# Altium project Wireless_thermomometer.PrjPcb
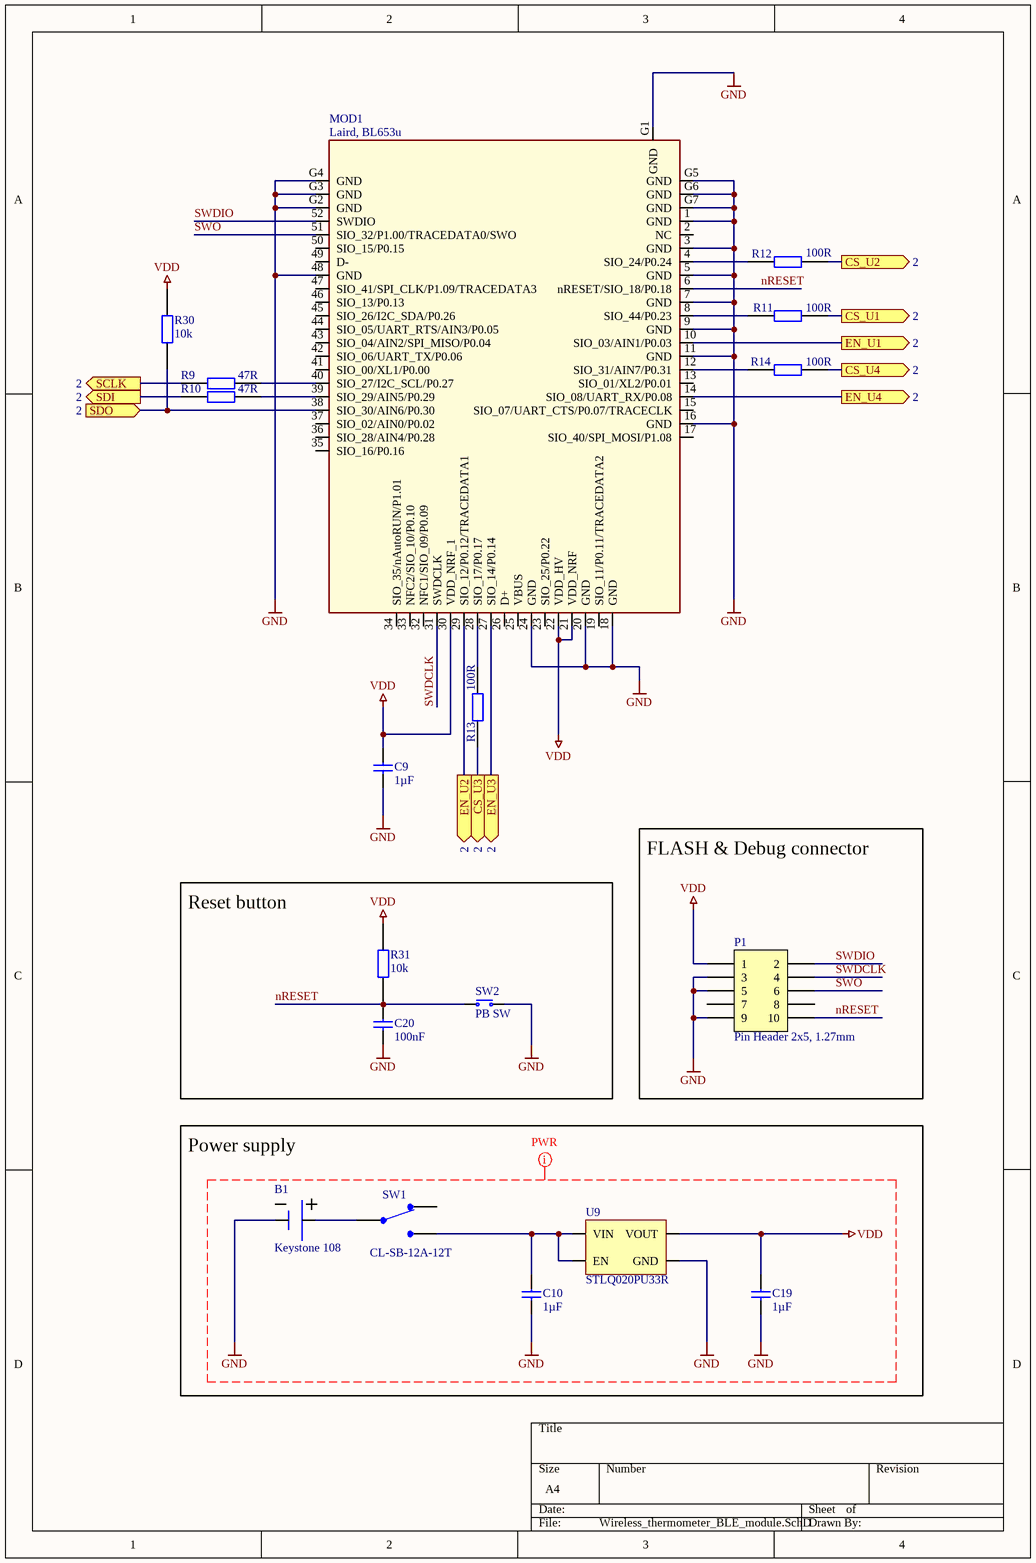
[diagram p0: Wireless_thermometer_BLE_module.SchDoc]
Name: Vladimír Pokorný; University_1: Brno University of Technology; University_2: Johannes Kepler University; URL: www.vladimirpokorny.cz
2 sheets, 74 parts. Net scope: flat (ports and power ports of the same name join across sheets).
Board files: Wireless_thermometer_one_PCB.PcbDoc, Wireless_thermometer_PCB_panel.PcbDoc
Sheets:
  Wireless_thermometer_BLE_module.SchDoc
  Wireless_thermometer_sensors.SchDoc

## Sheet Wireless_thermometer_BLE_module.SchDoc
size A4 portrait; SheetNumber: 1; SheetTotal: 2

### Parts
B1  Keystone 108  [Keystone 108]
C9  1µF  [CAPC1005X04L]
C10  1µF  [CAPC1005X04L]
C19  1µF  [CAPC1005X04L]
C20  100nF  [CAPC1005X04L]
MOD1  Laird, BL653u  [Laird, BL653u]
P1  Pin Header 2x5, 1.27mm  [HDR_2x5-SMD-1.27mm-K]
R9  47R  [RESC1005X04L]
R10  47R  [RESC1005X04L]
R11  100R  [RESC1005X04L]
R12  100R  [RESC1005X04L]
R13  100R  [RESC1005X04L]
R14  100R  [RESC1005X04L]
R30  10k  [RESC1005X04L]
R31  10k  [RESC1005X04L]
SW1  CL-SB-12A-12T  [CL-SB-12A-12T]
SW2  PB SW  [C&K_PTS810]
U9  STLQ020PU33R  [STLQ020PU33R]

### Ports
CS_U1 (out, see 2), CS_U2 (out, see 2), CS_U3 (out, see 2), CS_U4 (out, see 2), EN_U1 (out, see 2), EN_U2 (out, see 2), EN_U3 (out, see 2), EN_U4 (out, see 2), SCLK (out, see 2), SDI (out, see 2), SDO (in, see 2)

### Nets
GND: B1.2 C9.1 C10.1 C19.1 C20.1 MOD1.1(GND) MOD1.3(GND) MOD1.5(GND) MOD1.7(GND) MOD1.9(GND) MOD1.11(GND) MOD1.16(GND) MOD1.18(GND) MOD1.20(GND) MOD1.24(GND) MOD1.48(GND) MOD1.G1(GND) MOD1.G2(GND) MOD1.G3(GND) MOD1.G4(GND) MOD1.G5(GND) MOD1.G6(GND) MOD1.G7(GND) P1.3 P1.5 P1.9 SW2.1(N.O) U9.3(GND)
VDD: C9.2 C19.2 MOD1.21(VDD_NRF) MOD1.22(VDD_HV) MOD1.30(VDD_NRF_1) P1.1 R30.2 R31.2 U9.1(VOUT)
CS_U1: R11.2 ; port CS_U1
CS_U2: R12.2 ; port CS_U2
CS_U3: R13.2 ; port CS_U3
CS_U4: R14.2 ; port CS_U4
EN_U1: MOD1.10(SIO_03/AIN1/P0.03) ; port EN_U1
EN_U2: MOD1.29(SIO_12/P0.12/TRACEDATA1) ; port EN_U2
EN_U3: MOD1.27(SIO_14/P0.14) ; port EN_U3
EN_U4: MOD1.14(SIO_08/UART_RX/P0.08) ; port EN_U4
nRESET: C20.2 MOD1.6(nRESET/SIO_18/P0.18) P1.10 R31.1 SW2.2(COM)  [project net nRESET_1]
SCLK: R9.1 ; port SCLK
SDI: R10.1 ; port SDI
SDO: MOD1.38(SIO_30/AIN6/P0.30) R30.1 ; port SDO
SWDCLK: MOD1.31(SWDCLK) P1.4  [project net SWDCLK_1]
SWDIO: MOD1.52(SWDIO) P1.2  [project net SWDIO_1]
SWO: MOD1.51(SIO_32/P1.00/TRACEDATA0/SWO) P1.6  [project net SWO_1]
NetB1_1: B1.1 SW1.2
NetC10_2: C10.2 SW1.3 U9.4(EN) U9.6(VIN)
NetMOD1_4: MOD1.4(SIO_24/P0.24) R12.1
NetMOD1_8: MOD1.8(SIO_44/P0.23) R11.1
NetMOD1_12: MOD1.12(SIO_31/AIN7/P0.31) R14.1
NetMOD1_28: MOD1.28(SIO_17/P0.17) R13.1
NetMOD1_39: MOD1.39(SIO_29/AIN5/P0.29) R10.2
NetMOD1_40: MOD1.40(SIO_27/I2C_SCL/P0.27) R9.2

Not connected (* = marked no-connect by the designer): MOD1 2(NC) 13(SIO_01/XL2/P0.01) 15(SIO_07/UART_CTS/P0.07/TRACECLK) 17(SIO_40/SPI_MOSI/P1.08) 19(SIO_11/P0.11/TRACEDATA2) 23(SIO_25/P0.22___________) 25(VBUS) 26(D+) 32(NFC1/SIO_09/P0.09) 33(NFC2/SIO_10/P0.10) 34(SIO_35/nAutoRUN/P1.01) 35(SIO_16/P0.16) 36(SIO_28/AIN4/P0.28) 37(SIO_02/AIN0/P0.02) 41(SIO_00/XL1/P0.00) 42(SIO_06/UART_TX/P0.06) 43(SIO_04/AIN2/SPI_MISO/P0.04) 44(SIO_05/UART_RTS/AIN3/P0.05) 45(SIO_26/I2C_SDA/P0.26) 46(SIO_13/P0.13) 47(SIO_41/SPI_CLK/P1.09/TRACEDATA3) 49(D-) 50(SIO_15/P0.15); P1 7 8; SW1 1

### Layout directives
net class PWR: GND, VDD

### Notes on the sheet
- Reset button
- (near P1) FLASH & Debug connector
- Power supply

### Library data of the parts
B1 = Keystone 108: Tip Plg 108 Phe Bagged NKL#9HHS108; Manufacturer: Keystone Electronics; Manufacturer Part Number: 108; Body Material: Plastic; Number of Batteries: 1; Lead Length: 3.56mm; Approvals: UL; Supplier 1: Digi-Key; RoHS: Yes; Category: Batteries and Accessories; Stock 1: 10973; Pricing 1: 1=1,50000, 25=1,27160, 100=1,04920, 250=0,96544, 500=0,90634, 1000=0,84723, 2500=0,76842, 5000=0,70931 (USD); Mount: Through Hole,PCB,Screw; Number of Pins: 2; Material: Brass,Plastic; Contact Plating: Nickel,Tin; Contact Material: Brass,Nickel; Min Operating Temperature: -50°C; Max Operating Temperature: 145°C; Package Quantity: 1; Packaging: Tray; Termination: PC Pin; Number of Cells: 1; Series: -; Lead Free: Lead Free; REACH SVHC: No SVHC; ComponentLink1URL: https://datasheet.ciiva.com/3/108-3991.pdf?src-supplier=Digi-Key; ComponentLink1Description: https://datasheet.ciiva.com/3/108-3991.pdf?src-supplier=Digi-Key; ComponentLink2URL: https://datasheet.ciiva.com/1391/1718250-1391263.pdf?src-supplier=Element14; ComponentLink2Description: https://datasheet.ciiva.com/1391/1718250-1391263.pdf?src-supplier=Element14; ComponentLink3URL: https://datasheet.ciiva.com/20221/18-0102-20221614.pdf?src-supplier=Rapid+Electronics; ComponentLink3Description: https://datasheet.ciiva.com/20221/18-0102-20221614.pdf?src-supplier=Rapid+Electronics; ComponentLink4URL: https://datasheet.ciiva.com/20221/18-2995-20221661.pdf?src-supplier=Rapid+Electronics; ComponentLink4Description: https://datasheet.ciiva.com/20221/18-2995-20221661.pdf?src-supplier=Rapid+Electronics; ComponentLink5URL: https://datasheet.ciiva.com/16322/m60-2p18-16322534.pdf?src-supplier=Future+Electronics; ComponentLink5Description: https://datasheet.ciiva.com/16322/m60-2p18-16322534.pdf?src-supplier=Future+Electronics; Supplier Part Number 1: 36-108-ND
C9 C10 C19 C20 = CAP_0402: Capacitor, X7R, ±10%; Part Number: C0402-1µ0; LatestRevisionDate: 2016-08-22; Pin Count: 2; Publisher: Nordic Semiconductor; Published: 2009-05-08; Footprint Doc: 0402
  C9 C10 C19: Value: 1µF
  C20: Value: 100nF
MOD1 = Laird, BL653u: BL653µ Integrated Antenna module, 453-00059; Substitutes Allowed: NO; Datasheet Link: https://connectivity-staging.s3.us-east-2.amazonaws.com/s3fs-public/2018-12/BL654%20Datasheet%20v1_6.pdf; Mounting: SMT; Operating Temperature: -40C~85C; Manufacturer Part Number: 453-00059; Manufacturer: Laird; Footprint: Laird, Module, BL653u-SA
P1 = Pin Header 2x5 SMD, 1.27mm, KS: Pin Header 2x5, 1.27mm (50mil), SMD, Keying Shroud; Manufacturer: W-CON; Manufacturer Part Number: 3132-10MS0BK00R1; Part number IPS: 00000009968; Artikkelnr Noca: 55010009; Part Number: Pin Header 2x5 SMD, 1.27mm, KS; Footprint Doc: HDR_2x5-SMD-1.27mm; LatestRevisionDate: 2016-04-21; Pin Count: 10; Publisher: Nordic Semiconductor; Published: 2016-01-22; Value: Pin Header 2x5, 1.27mm; Note: *; ComponentLink1URL: *; ComponentLink1Description: Datasheet; ComponentLink2URL: *; ComponentLink2Description: Supplier link; HelpURL: \\hizz\pro\app9717\Datasheet\connectores\W-CON\3132-XXMXXBK00XX.pdf; Supplier 1: Cabcon; Supplier Part Number 1: 3132-10MS0BK00R1; Supplier 2: Samtec; Supplier Part Number 2: FTSH-105-01-F-DV-K
R9 R10 = RES_0402: Resistor; Part Number: R0603-430R; Value: 430R; LatestRevisionDate: 2015-06-10; Pin Count: 2; Publisher: Nordic Semiconductor; Published: 2015-06-10; Footprint Doc: 0603
R11-R14 R30 R31 = RES_0402: Resistor; Part Number: R0603-430R; LatestRevisionDate: 2015-06-10; Pin Count: 2; Publisher: Nordic Semiconductor; Published: 2015-06-10; Footprint Doc: 0603
  R11-R14: Value: 100R
  R30 R31: Value: 10k
SW1 = CL-SB-12A-12T: Slide Switch, 2 Positions, SPDT, Latched, 0.2A, 12VDC, Solder Terminal, Through Hole-right Angle; Manufacturer: Nidec Copal; Actuator Material: Nylon,Polyamide; Contact Style: Non-Shorting; Electrical Life: 10000Cycles; Actuator Type: Standard; Switch Function: On-On; Switch Travel: 2mm; Current Rating: 200mA; Voltage Rating (DC): 12V; Operating Force: 153gf; Supplier 1: Newark; Manufacturer Part Number: CL-SB-12A-12T; RoHS: Yes; Category: Slide Switches; Stock 1: 490; Pricing 1: 1=1,08000, 10=1,03000, 25=0,97200, 50=0,91300, 100=0,85000, 250=0,78000 (USD); Mount: Surface Mount; Contact Plating: Gold; Contact Material: Copper; Min Operating Temperature: -40°C; Max Operating Temperature: 85°C; Throw Configuration: SPDT; Packaging: Tape and Reel; Actuator Length: 2mm; ComponentLink1URL: https://datasheet.ciiva.com/6462/cl-sb-6462005.pdf?src-supplier=Digi-Key; ComponentLink1Description: https://datasheet.ciiva.com/6462/cl-sb-6462005.pdf?src-supplier=Digi-Key; ComponentLink2URL: https://datasheet.ciiva.com/6462/cl-sb-6462006.pdf?src-supplier=Digi-Key; ComponentLink2Description: https://datasheet.ciiva.com/6462/cl-sb-6462006.pdf?src-supplier=Digi-Key; ComponentLink3URL: https://datasheet.ciiva.com/6462/cl-sb-6462009.pdf?src-supplier=Digi-Key; ComponentLink3Description: https://datasheet.ciiva.com/6462/cl-sb-6462009.pdf?src-supplier=Digi-Key; Supplier Part Number 1: 56AC5276
SW2 = PTS810 SJK 250 SMTR LFS: Tactile Switch, SPNO, SMD, 260gf, 4.2x3.2x2.5mm; Manufacturer: C&K Components; Part number IPS: 00000001259; Artikkelnr Noca: N.A.; Part Number: PTS810 SJK 250 SMTR LFS; Manufacturer Part Number: PTS810 SJK 250 SMTR LFS; LatestRevisionDate: 2017-11-09; Pin Count: 4; Publisher: Nordic Semiconductor; Published: 2017-09-18; Value: PB SW; Note: *; Footprint Doc: PTS810; ComponentLink1Description: Datasheet; ComponentLink1URL: *; ComponentLink2Description: Supplier link; ComponentLink2URL: *; HelpURL: http://www.ckswitches.com/media/1476/pts810.pdf; Supplier 1: Digi-Key; Supplier Part Number 1: CKN10503TR-ND; Supplier 2: *; Supplier Part Number 2: *
U9 = STLQ020PU33R: Ldo, Fixed, 3.3V, 0.2A, -40 to 125DEG C;; Manufacturer: STMicroelectronics; Supplier 1: Mouser; Manufacturer Part Number: STLQ020PU33R; RoHS: No; Category: Uncategorized; Stock 1: 5768; Pricing 1: 1=0,60000, 10=0,49400, 50=0,49400, 100=0,40300, 1000=0,25500, 10000=0,24000 (USD); Supplier Part Number 1: 511-STLQ020PU33R

## Sheet Wireless_thermometer_sensors.SchDoc
size A3; SheetNumber: 2; SheetTotal: 2
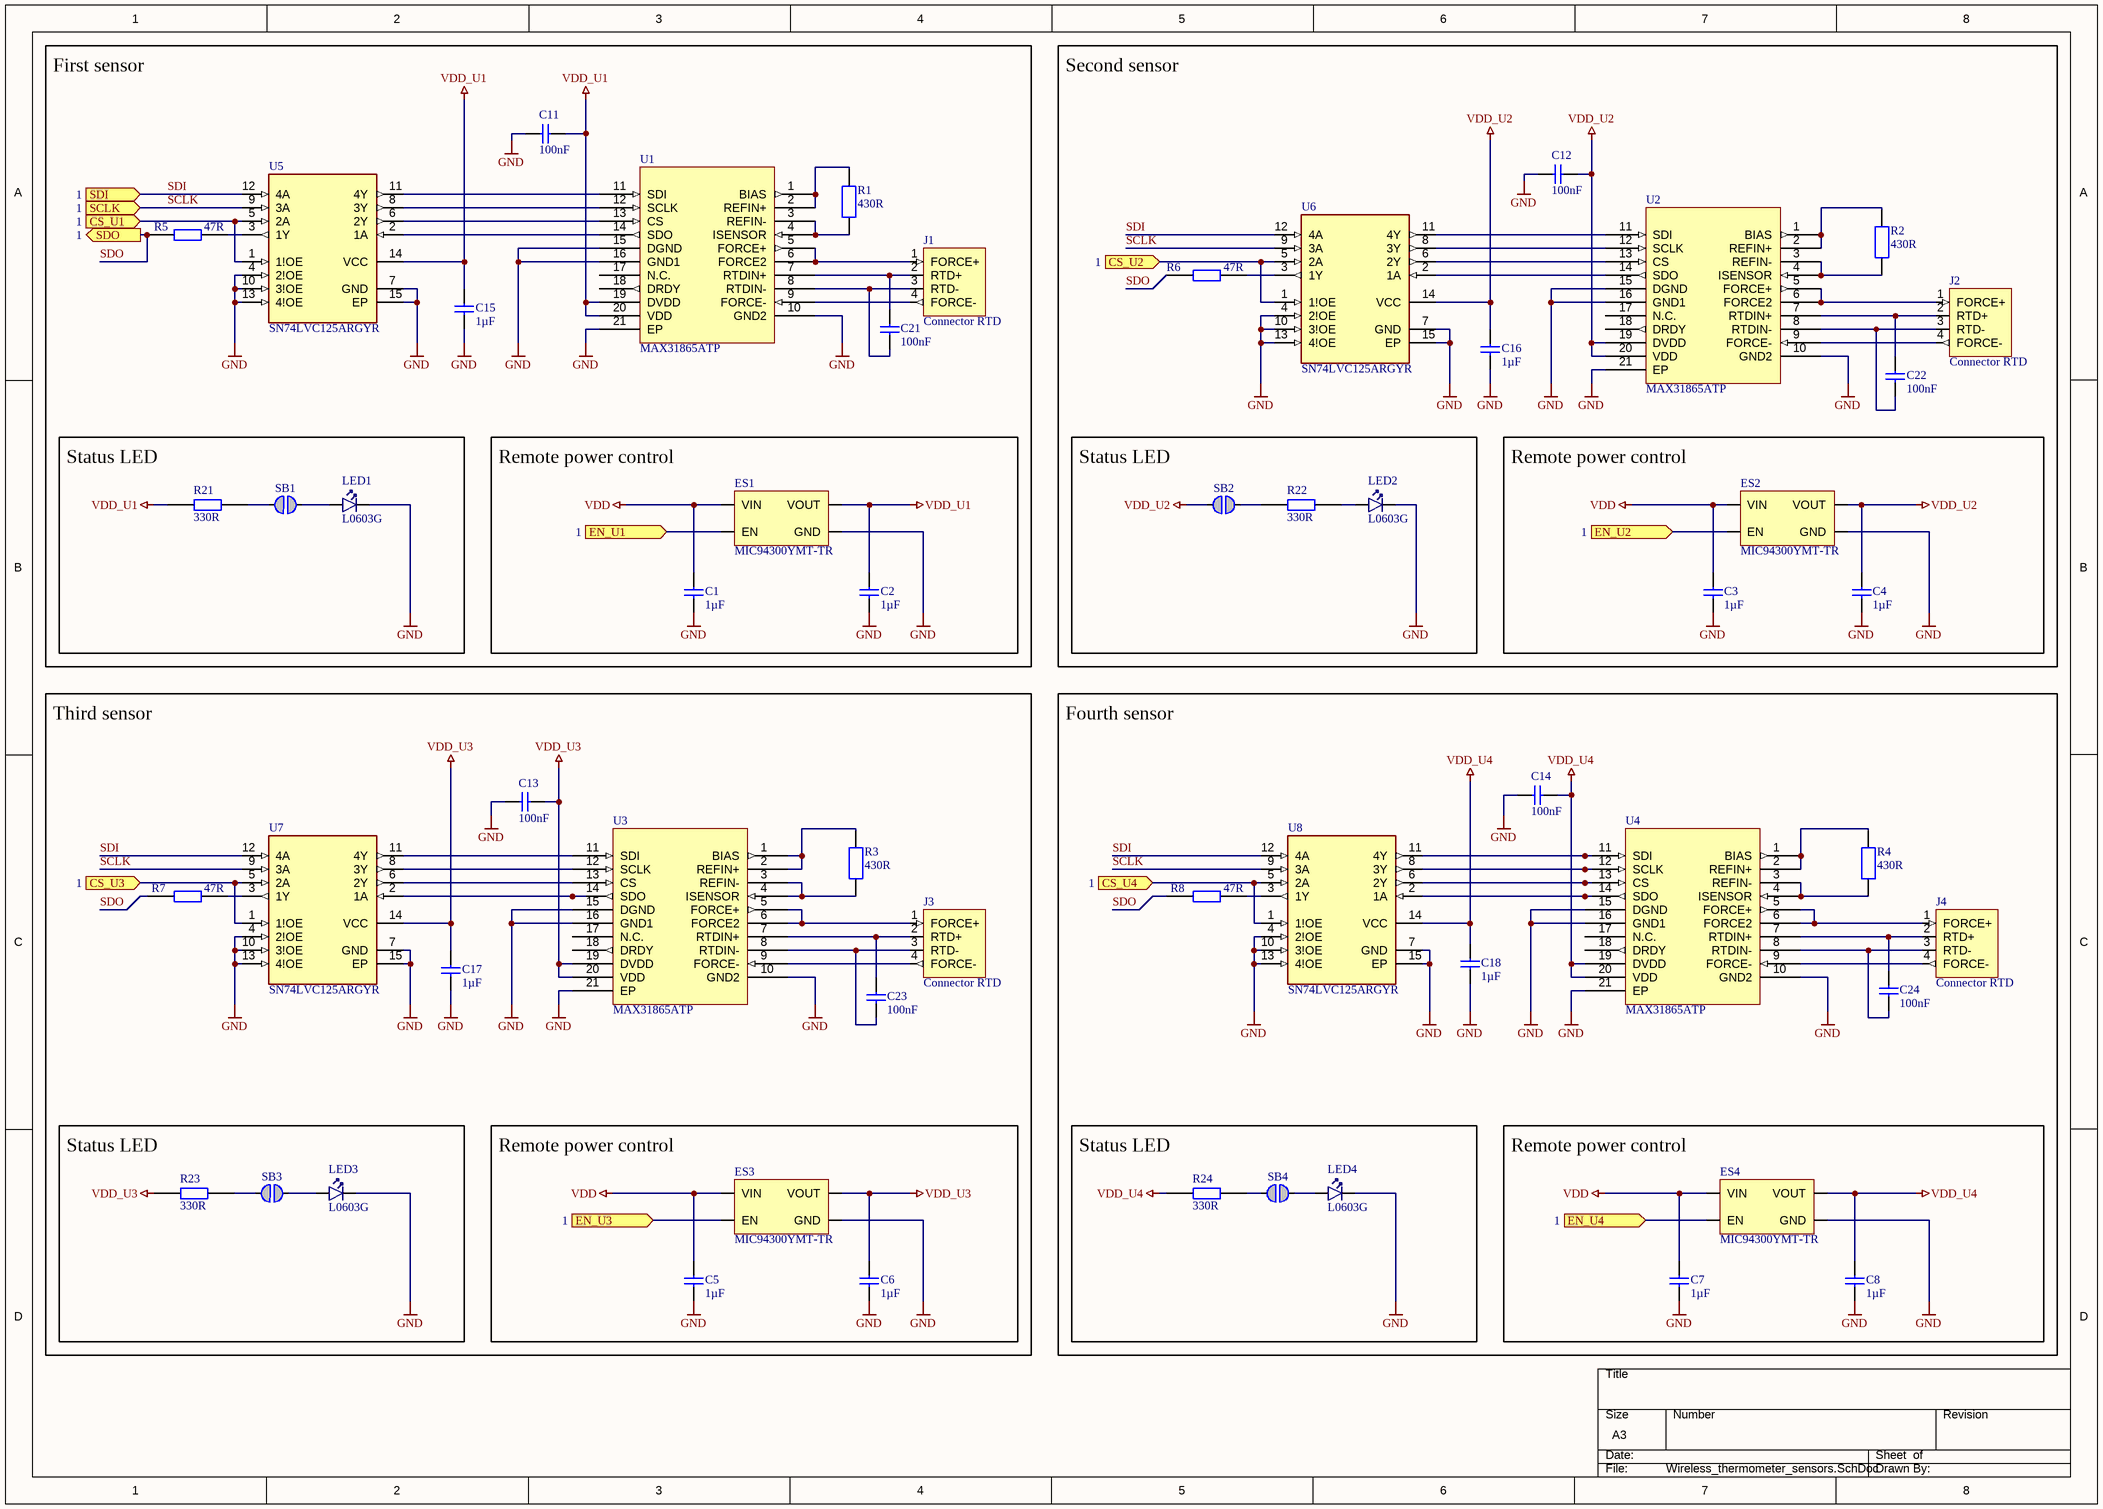
[diagram p1: Wireless_thermometer_sensors.SchDoc]

### Parts
C1  1µF  [CAPC1005X04L]
C2  1µF  [CAPC1005X04L]
C3  1µF  [CAPC1005X04L]
C4  1µF  [CAPC1005X04L]
C5  1µF  [CAPC1005X04L]
C6  1µF  [CAPC1005X04L]
C7  1µF  [CAPC1005X04L]
C8  1µF  [CAPC1005X04L]
C11  100nF  [CAPC1005X04L]
C12  100nF  [CAPC1005X04L]
C13  100nF  [CAPC1005X04L]
C14  100nF  [CAPC1005X04L]
C15  1µF  [CAPC1005X04L]
C16  1µF  [CAPC1005X04L]
C17  1µF  [CAPC1005X04L]
C18  1µF  [CAPC1005X04L]
C21  100nF  [CAPC1005X04L]
C22  100nF  [CAPC1005X04L]
C23  100nF  [CAPC1005X04L]
C24  100nF  [CAPC1005X04L]
ES1  MIC94300YMT-TR  [MIC94300YMT-TR]
ES2  MIC94300YMT-TR  [MIC94300YMT-TR]
ES3  MIC94300YMT-TR  [MIC94300YMT-TR]
ES4  MIC94300YMT-TR  [MIC94300YMT-TR]
J1  Connector RTD  [CON-RTD]
J2  Connector RTD  [CON-RTD]
J3  Connector RTD  [CON-RTD]
J4  Connector RTD  [CON-RTD]
LED1  L0603G  [LED_0603_G]
LED2  L0603G  [LED_0603_G]
LED3  L0603G  [LED_0603_G]
LED4  L0603G  [LED_0603_G]
R1  430R  [RESR1608X06]
R2  430R  [RESR1608X06]
R3  430R  [RESR1608X06]
R4  430R  [RESR1608X06]
R5  47R  [RESC1005X04L]
R6  47R  [RESC1005X04L]
R7  47R  [RESC1005X04L]
R8  47R  [RESC1005X04L]
R21  330R  [RESC1005X04L]
R22  330R  [RESC1005X04L]
R23  330R  [RESC1005X04L]
R24  330R  [RESC1005X04L]
SB1  Solderbridge  [Solderbridge]  (value not drawn)  (no BOM)
SB2  Solderbridge  [Solderbridge]  (value not drawn)  (no BOM)
SB3  Solderbridge  [Solderbridge]  (value not drawn)  (no BOM)
SB4  Solderbridge  [Solderbridge]  (value not drawn)  (no BOM)
U1  MAX31865ATP  [21-0140L_T2055-5_MXM-L]
U2  MAX31865ATP  [21-0140L_T2055-5_MXM-L]
U3  MAX31865ATP  [21-0140L_T2055-5_MXM-L]
U4  MAX31865ATP  [21-0140L_T2055-5_MXM-L]
U5  SN74LVC125ARGYR  [QFN50P350X350X100-15N]
U6  SN74LVC125ARGYR  [QFN50P350X350X100-15N]
U7  SN74LVC125ARGYR  [QFN50P350X350X100-15N]
U8  SN74LVC125ARGYR  [QFN50P350X350X100-15N]

### Ports
CS_U1 (in, see 1), CS_U2 (in, see 1), CS_U3 (in, see 1), CS_U4 (in, see 1), EN_U1 (in, see 1), EN_U2 (in, see 1), EN_U3 (in, see 1), EN_U4 (in, see 1), SCLK (in, see 1), SDI (in, see 1), SDO (out, see 1)

### Nets
GND: C1.1 C2.1 C3.1 C4.1 C5.1 C6.1 C7.1 C8.1 C11.1 C12.1 C13.2 C14.1 C15.1 C16.1 C17.1 C18.1 ES1.2(GND) ES2.2(GND) ES3.2(GND) ES4.2(GND) LED1.1(C) LED2.1(C) LED3.1(C) LED4.1(C) U1.10(GND2) U1.15(DGND) U1.16(GND1) U1.21(EP) U2.10(GND2) U2.15(DGND) U2.16(GND1) U2.21(EP) U3.10(GND2) U3.15(DGND) U3.16(GND1) U3.21(EP) U4.10(GND2) U4.15(DGND) U4.16(GND1) U4.21(EP) U5.4(2!OE) U5.7(GND) U5.10(3!OE) U5.13(4!OE) U5.15(EP) U6.4(2!OE) U6.7(GND) U6.10(3!OE) U6.13(4!OE) U6.15(EP) U7.4(2!OE) U7.7(GND) U7.10(3!OE) U7.13(4!OE) U7.15(EP) U8.4(2!OE) U8.7(GND) U8.10(3!OE) U8.13(4!OE) U8.15(EP)
VDD: C1.2 C3.2 C5.2 C7.2 ES1.4(VIN) ES2.4(VIN) ES3.4(VIN) ES4.4(VIN)
VDD_U1: C2.2 C11.2 C15.2 ES1.3(VOUT) R21.1 U1.19(DVDD) U1.20(VDD) U5.14(VCC)
VDD_U2: C4.2 C12.2 C16.2 ES2.3(VOUT) SB2.2 U2.19(DVDD) U2.20(VDD) U6.14(VCC)
VDD_U3: C6.2 C13.1 C17.2 ES3.3(VOUT) R23.1 U3.19(DVDD) U3.20(VDD) U7.14(VCC)
VDD_U4: C8.2 C14.2 C18.2 ES4.3(VOUT) R24.1 U4.19(DVDD) U4.20(VDD) U8.14(VCC)
CS_U1: U5.1(1!OE) U5.5(2A) ; port CS_U1
CS_U2: U6.1(1!OE) U6.5(2A) ; port CS_U2
CS_U3: U7.1(1!OE) U7.5(2A) ; port CS_U3
CS_U4: U8.1(1!OE) U8.5(2A) ; port CS_U4
EN_U1: ES1.1(EN) ; port EN_U1
EN_U2: ES2.1(EN) ; port EN_U2
EN_U3: ES3.1(EN) ; port EN_U3
EN_U4: ES4.1(EN) ; port EN_U4
SCLK: U5.9(3A) U6.9(3A) U7.9(3A) U8.9(3A) ; port SCLK
SDI: U5.12(4A) U6.12(4A) U7.12(4A) U8.12(4A) ; port SDI
SDO: R5.1 R6.1 R7.1 R8.1 ; port SDO
NetC21_1: C21.1 J1.3(RTD-) U1.8(RTDIN-)
NetC21_2: C21.2 J1.2(RTD+) U1.7(RTDIN+)
NetC22_1: C22.1 J2.3(RTD-) U2.8(RTDIN-)
NetC22_2: C22.2 J2.2(RTD+) U2.7(RTDIN+)
NetC23_1: C23.1 J3.3(RTD-) U3.8(RTDIN-)
NetC23_2: C23.2 J3.2(RTD+) U3.7(RTDIN+)
NetC24_1: C24.1 J4.3(RTD-) U4.8(RTDIN-)
NetC24_2: C24.2 J4.2(RTD+) U4.7(RTDIN+)
NetJ1_1: J1.1(FORCE+) U1.5(FORCE+) U1.6(FORCE2)
NetJ1_4: J1.4(FORCE-) U1.9(FORCE-)
NetJ2_1: J2.1(FORCE+) U2.5(FORCE+) U2.6(FORCE2)
NetJ2_4: J2.4(FORCE-) U2.9(FORCE-)
NetJ3_1: J3.1(FORCE+) U3.5(FORCE+) U3.6(FORCE2)
NetJ3_4: J3.4(FORCE-) U3.9(FORCE-)
NetJ4_1: J4.1(FORCE+) U4.5(FORCE+) U4.6(FORCE2)
NetJ4_4: J4.4(FORCE-) U4.9(FORCE-)
NetLED1_2: LED1.2(A) SB1.1
NetLED2_2: LED2.2(A) R22.2
NetLED3_2: LED3.2(A) SB3.1
NetLED4_2: LED4.2(A) SB4.1
NetR1_1: R1.1 U1.3(REFIN-) U1.4(ISENSOR)
NetR1_2: R1.2 U1.1(BIAS) U1.2(REFIN+)
NetR2_1: R2.1 U2.3(REFIN-) U2.4(ISENSOR)
NetR2_2: R2.2 U2.1(BIAS) U2.2(REFIN+)
NetR3_1: R3.1 U3.3(REFIN-) U3.4(ISENSOR)
NetR3_2: R3.2 U3.1(BIAS) U3.2(REFIN+)
NetR4_1: R4.1 U4.3(REFIN-) U4.4(ISENSOR)
NetR4_2: R4.2 U4.1(BIAS) U4.2(REFIN+)
NetR5_2: R5.2 U5.3(1Y)
NetR6_2: R6.2 U6.3(1Y)
NetR7_2: R7.2 U7.3(1Y)
NetR8_2: R8.2 U8.3(1Y)
NetR21_2: R21.2 SB1.2
NetR22_1: R22.1 SB2.1
NetR23_2: R23.2 SB3.2
NetR24_2: R24.2 SB4.2
NetU1_11: U1.11(SDI) U5.11(4Y)
NetU1_12: U1.12(SCLK) U5.8(3Y)
NetU1_13: U1.13(CS) U5.6(2Y)
NetU1_14: U1.14(SDO) U5.2(1A)
NetU2_11: U2.11(SDI) U6.11(4Y)
NetU2_12: U2.12(SCLK) U6.8(3Y)
NetU2_13: U2.13(CS) U6.6(2Y)
NetU2_14: U2.14(SDO) U6.2(1A)
NetU3_11: U3.11(SDI) U7.11(4Y)
NetU3_12: U3.12(SCLK) U7.8(3Y)
NetU3_13: U3.13(CS) U7.6(2Y)
NetU3_14: U3.14(SDO) U7.2(1A)
NetU4_11: U4.11(SDI) U8.11(4Y)
NetU4_12: U4.12(SCLK) U8.8(3Y)
NetU4_13: U4.13(CS) U8.6(2Y)
NetU4_14: U4.14(SDO) U8.2(1A)

Not connected (* = marked no-connect by the designer): U1 17(N.C.) 18(DRDY); U2 17(N.C.) 18(DRDY); U3 17(N.C.) 18(DRDY); U4 17(N.C.) 18(DRDY)

### Notes on the sheet
- Status LED
- Remote power control
- First sensor
- Second sensor
- Third sensor
- Fourth sensor

### Library data of the parts
C1-C8 C11-C18 C21-C24 = CAP_0402: as C9 on sheet Wireless_thermometer_BLE_module; LatestRevisionDate: 2016-08-22; Pin Count: 2; Publisher: Nordic Semiconductor; Published: 2009-05-08; Footprint Doc: 0402
  C1-C8 C15-C18: Value: 1µF
  C11-C14 C21-C24: Value: 100nF
ES1-ES4 = MIC94300YMT-TR: MIC94300 Series Single 3.6 V 200 mA Ripple Blocker Technology Load Switch -MLF-4; Manufacturer: Microchip; Number of Outputs: 1; Output Current: 200mA; Interface: On/Off; Output Configuration: High Side; Turn-On Delay Time: 150us; Max Supply Current: 1uA; Fault Protection: Over Temperature; Operating Supply Voltage: 3.6V; Supplier 1: Digi-Key; Manufacturer Part Number: MIC94300YMT-TR; RoHS: Yes; Category: Hot Swap Controllers; Stock 1: 47472; Pricing 1: 1=0,34000, 25=0,30000 (USD); Mount: Surface Mount; Number of Pins: 4; Min Operating Temperature: -40°C; Max Operating Temperature: 125°C; Packaging: Tape and Reel; Package Quantity: 5000; Max Output Current: 200mA; Series: Ripple Blocker™; Current Rating: 200mA; Rated Current-Max: 200mA; Radiation Hardening: No; RoHS Compliant: Yes; Lead Free: Lead Free; REACH SVHC: No SVHC; ComponentLink1URL: https://datasheet.ciiva.com/1957/mic94300-1957169.pdf?src-supplier=Digi-Key; ComponentLink1Description: https://datasheet.ciiva.com/1957/mic94300-1957169.pdf?src-supplier=Digi-Key; ComponentLink2URL: https://datasheet.ciiva.com/22629/1563190-22629143.pdf?src-supplier=Element14; ComponentLink2Description: https://datasheet.ciiva.com/22629/1563190-22629143.pdf?src-supplier=Element14; ComponentLink3URL: https://datasheet.ciiva.com/1955/mic94300-1955787.pdf?src-supplier=Digi-Key; ComponentLink3Description: https://datasheet.ciiva.com/1955/mic94300-1955787.pdf?src-supplier=Digi-Key; ComponentLink4URL: https://datasheet.ciiva.com/1956/mic94300-1956219.pdf?src-supplier=Digi-Key; ComponentLink4Description: https://datasheet.ciiva.com/1956/mic94300-1956219.pdf?src-supplier=Digi-Key; ComponentLink5URL: https://datasheet.ciiva.com/15200/getdatasheetpartid-478360-15200797.pdf?src-supplier=Verical; ComponentLink5Description: https://datasheet.ciiva.com/15200/getdatasheetpartid-478360-15200797.pdf?src-supplier=Verical; Supplier Part Number 1: 576-4011-1-ND
J1-J4 = CON-RTD
LED1-LED4 = D:LED: LED, Green, 0603, 573nm, Vf=2.0V, 24mcd, - 40 to +85°C; Part Number: VS 25C7M5; Manufacturer: Victory Electronics; Part number IPS: N.A.; Artikkelnr Noca: 13019193; Manufacturer Part Number: VS 25C7M5; Footprint Doc: 0603; LatestRevisionDate: 2017-08-21; Pin Count: 2; Publisher: Nordic Semiconductor; Published: 2017-08-21; Value: L0603G; Note: *; ComponentLink1URL: *; ComponentLink1Description: Datasheet; ComponentLink2URL: *; ComponentLink2Description: Supplier link; HelpURL: \\hizz\pro\app9717\Datasheet\optoelectronics\Victory Electronics\VS 25C7M5.pdf; Supplier 1: EC Partner; Supplier Part Number 1: *; Supplier 2: *; Supplier Part Number 2: *
R1-R4 = RES_0603: Resistor; Part Number: R0603-430R; LatestRevisionDate: 2015-06-10; Pin Count: 2; Publisher: Nordic Semiconductor; Published: 2015-06-10; Value: 430R; Footprint Doc: 0603
R5-R8 = RES_0402: as R9 on sheet Wireless_thermometer_BLE_module; LatestRevisionDate: 2015-06-10; Pin Count: 2; Publisher: Nordic Semiconductor; Published: 2015-06-10; Footprint Doc: 0603
R21-R24 = RES_0402: Resistor; Part Number: R0603-430R; LatestRevisionDate: 2015-06-10; Pin Count: 2; Publisher: Nordic Semiconductor; Published: 2015-06-10; Value: 330R; Footprint Doc: 0603
SB1-SB4 = SOLDERBRIDGE: Artikkelnr Noca: N.A.; Part Number: Solderbridge; Manufacturer: *; Manufacturer Part Number: *; LatestRevisionDate: 2009-12-14; Pin Count: 2; Publisher: Nordic Semiconductor; Published: 2009-12-14; Value: Solderbridge; Note: *; Footprint Doc: Solderbridge; Part number IPS: N.A.; ComponentLink1URL: *; ComponentLink1Description: Datasheet; ComponentLink2URL: *; ComponentLink2Description: Supplier link; HelpURL: *; Supplier 1: *; Supplier Part Number 1: *; Supplier 2: *; Supplier Part Number 2: *
U1-U4 = MAX31865ATP: Circuit Protection Misc Resistance Temperature Detector to Digital Converter; Manufacturer: Maxim; Manufacturer Part Number: MAX31865ATP+T; Interface: SPI; Supplier 1: Future Electronics; RoHS: Yes; Category: Power Management ICs; Pricing 1: 2500=4,42000 (USD); Case/Package: QFN; Number of Pins: 20; Min Operating Temperature: -40°C; Max Operating Temperature: 125°C; Packaging: Tape and Reel; Package Quantity: 2500; Output Type: SPI; Series: -; Radiation Hardening: No; RoHS Compliant: Yes; ComponentLink1URL: https://datasheet.ciiva.com/14320/max31865-14320743.pdf?src-supplier=Avnet; ComponentLink1Description: https://datasheet.ciiva.com/14320/max31865-14320743.pdf?src-supplier=Avnet; ComponentLink2URL: https://datasheet.ciiva.com/25893/max31865-25893916.pdf?src-supplier=Avnet+Europe; ComponentLink2Description: https://datasheet.ciiva.com/25893/max31865-25893916.pdf?src-supplier=Avnet+Europe; ComponentLink3URL: https://datasheet.ciiva.com/14083/max31865-14083679.pdf?src-supplier=Digi-Key; ComponentLink3Description: https://datasheet.ciiva.com/14083/max31865-14083679.pdf?src-supplier=Digi-Key; Supplier Part Number 1: 9084949
U5-U8 = SN74LVC125ARGYR: Quadruple Bus Buffer Gate With 3-State Outputs 14-VQFN -40 to 125; Value: *; Availability: Unavailable; Package: None; MP: SN74LVC125ARGYR; Price: None

## Nets that join several sheets
GND: Wireless_thermometer_BLE_module (28 pins), Wireless_thermometer_sensors (60 pins)
VDD: Wireless_thermometer_BLE_module (9 pins), Wireless_thermometer_sensors (8 pins)
CS_U1: Wireless_thermometer_BLE_module (R11.2), Wireless_thermometer_sensors (U5.1 U5.5)
CS_U2: Wireless_thermometer_BLE_module (R12.2), Wireless_thermometer_sensors (U6.1 U6.5)
CS_U3: Wireless_thermometer_BLE_module (R13.2), Wireless_thermometer_sensors (U7.1 U7.5)
CS_U4: Wireless_thermometer_BLE_module (R14.2), Wireless_thermometer_sensors (U8.1 U8.5)
EN_U1: Wireless_thermometer_BLE_module (MOD1.10), Wireless_thermometer_sensors (ES1.1)
EN_U2: Wireless_thermometer_BLE_module (MOD1.29), Wireless_thermometer_sensors (ES2.1)
EN_U3: Wireless_thermometer_BLE_module (MOD1.27), Wireless_thermometer_sensors (ES3.1)
EN_U4: Wireless_thermometer_BLE_module (MOD1.14), Wireless_thermometer_sensors (ES4.1)
SCLK: Wireless_thermometer_BLE_module (R9.1), Wireless_thermometer_sensors (U5.9 U6.9 U7.9 U8.9)
SDI: Wireless_thermometer_BLE_module (R10.1), Wireless_thermometer_sensors (U5.12 U6.12 U7.12 U8.12)
SDO: Wireless_thermometer_BLE_module (MOD1.38 R30.1), Wireless_thermometer_sensors (R5.1 R6.1 R7.1 R8.1)